# Altium schematic sheet Main.SchDoc
size B portrait; SheetNumber: 1; SheetTotal: 3
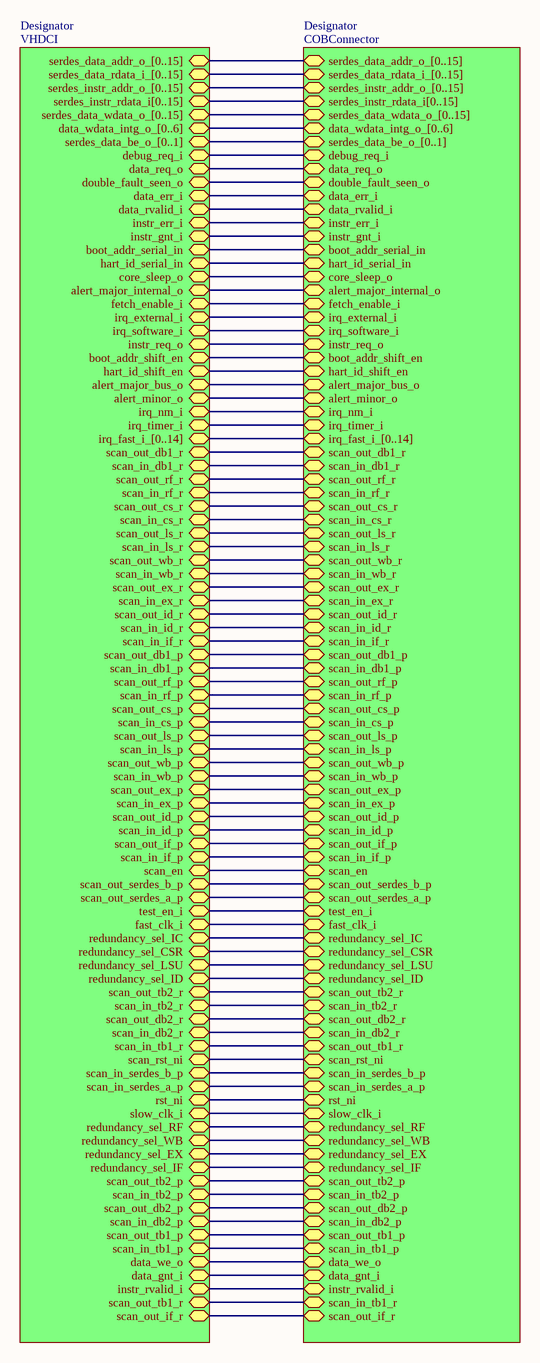
[diagram p0: Main.SchDoc]

## Sub-sheets
Designator = VHDCI: serdes_data_addr_o_[0..15] (bidir), serdes_data_rdata_i_[0..15] (bidir), serdes_instr_addr_o_[0..15] (bidir), serdes_instr_rdata_i[0..15] (bidir), serdes_data_wdata_o_[0..15] (bidir), data_wdata_intg_o_[0..6] (bidir), serdes_data_be_o_[0..1] (bidir), data_req_o (bidir), double_fault_seen_o (bidir), data_err_i (bidir), data_rvalid_i (bidir), instr_err_i (bidir), instr_gnt_i (bidir), boot_addr_serial_in (bidir), hart_id_serial_in (bidir), core_sleep_o (bidir), alert_major_internal_o (bidir), fetch_enable_i (bidir), irq_external_i (bidir), irq_software_i (bidir), instr_req_o (bidir), boot_addr_shift_en (bidir), hart_id_shift_en (bidir), alert_major_bus_o (bidir), alert_minor_o (bidir), irq_nm_i (bidir), irq_timer_i (bidir), irq_fast_i_[0..14] (bidir), scan_out_db1_r (bidir), scan_in_db1_r (bidir), scan_out_rf_r (bidir), scan_in_rf_r (bidir), scan_out_cs_r (bidir), scan_in_cs_r (bidir), scan_out_ls_r (bidir), scan_in_ls_r (bidir), scan_out_wb_r (bidir), scan_in_wb_r (bidir), scan_out_ex_r (bidir), scan_in_ex_r (bidir), scan_out_id_r (bidir), scan_in_id_r (bidir), scan_out_if_r (bidir), scan_in_if_r (bidir), scan_out_db1_p (bidir), scan_in_db1_p (bidir), scan_out_rf_p (bidir), scan_in_rf_p (bidir), scan_out_cs_p (bidir), scan_in_cs_p (bidir), scan_out_ls_p (bidir), scan_in_ls_p (bidir), scan_out_wb_p (bidir), scan_in_wb_p (bidir), scan_out_ex_p (bidir), scan_in_ex_p (bidir), scan_out_id_p (bidir), scan_in_id_p (bidir), scan_out_if_p (bidir), scan_in_if_p (bidir), scan_en (bidir), scan_out_serdes_b_p (bidir), scan_out_serdes_a_p (bidir), test_en_i (bidir), fast_clk_i (bidir), redundancy_sel_IC (bidir), redundancy_sel_CSR (bidir), redundancy_sel_LSU (bidir), redundancy_sel_ID (bidir), scan_out_tb2_r (bidir), scan_in_tb2_r (bidir), scan_out_db2_r (bidir), scan_in_db2_r (bidir), scan_in_tb1_r (bidir), scan_rst_ni (bidir), scan_in_serdes_b_p (bidir), scan_in_serdes_a_p (bidir), rst_ni (bidir), slow_clk_i (bidir), redundancy_sel_RF (bidir), redundancy_sel_WB (bidir), redundancy_sel_EX (bidir), redundancy_sel_IF (bidir), scan_out_tb2_p (bidir), scan_in_tb2_p (bidir), scan_out_db2_p (bidir), scan_in_db2_p (bidir), scan_out_tb1_p (bidir), scan_in_tb1_p (bidir), debug_req_i (bidir), data_we_o (bidir), data_gnt_i (bidir), instr_rvalid_i (bidir), scan_out_tb1_r (bidir)
Designator = COBConnector: serdes_data_addr_o_[0..15] (bidir), serdes_data_rdata_i_[0..15] (bidir), serdes_instr_addr_o_[0..15] (bidir), serdes_data_wdata_o_[0..15] (bidir), data_wdata_intg_o_[0..6] (bidir), serdes_data_be_o_[0..1] (bidir), debug_req_i (bidir), data_req_o (bidir), double_fault_seen_o (bidir), data_err_i (bidir), data_rvalid_i (bidir), data_we_o (bidir), data_gnt_i (bidir), instr_err_i (bidir), instr_gnt_i (bidir), boot_addr_serial_in (bidir), hart_id_serial_in (bidir), core_sleep_o (bidir), alert_major_internal_o (bidir), fetch_enable_i (bidir), irq_external_i (bidir), irq_software_i (bidir), instr_req_o (bidir), boot_addr_shift_en (bidir), hart_id_shift_en (bidir), alert_major_bus_o (bidir), alert_minor_o (bidir), irq_nm_i (bidir), irq_timer_i (bidir), irq_fast_i_[0..14] (bidir), scan_out_db1_r (bidir), scan_in_db1_r (bidir), scan_out_rf_r (bidir), scan_in_rf_r (bidir), scan_out_cs_r (bidir), scan_in_cs_r (bidir), scan_out_ls_r (bidir), scan_in_ls_r (bidir), scan_out_wb_r (bidir), scan_in_wb_r (bidir), scan_out_ex_r (bidir), scan_in_ex_r (bidir), scan_out_id_r (bidir), scan_out_if_r (bidir), scan_in_if_r (bidir), scan_out_db1_p (bidir), scan_in_db1_p (bidir), scan_out_rf_p (bidir), scan_in_rf_p (bidir), scan_out_cs_p (bidir), scan_in_cs_p (bidir), scan_out_ls_p (bidir), scan_in_ls_p (bidir), scan_out_wb_p (bidir), scan_in_wb_p (bidir), scan_out_ex_p (bidir), scan_in_ex_p (bidir), scan_out_id_p (bidir), scan_in_id_p (bidir), scan_out_if_p (bidir), scan_in_if_p (bidir), scan_en (bidir), scan_out_serdes_b_p (bidir), scan_out_serdes_a_p (bidir), test_en_i (bidir), fast_clk_i (bidir), redundancy_sel_IC (bidir), redundancy_sel_CSR (bidir), redundancy_sel_LSU (bidir), redundancy_sel_ID (bidir), scan_out_tb2_r (bidir), scan_in_tb2_r (bidir), scan_out_db2_r (bidir), scan_in_db2_r (bidir), scan_out_tb1_r (bidir), scan_rst_ni (bidir), scan_in_serdes_b_p (bidir), scan_in_serdes_a_p (bidir), rst_ni (bidir), slow_clk_i (bidir), redundancy_sel_RF (bidir), redundancy_sel_WB (bidir), redundancy_sel_EX (bidir), redundancy_sel_IF (bidir), scan_out_tb2_p (bidir), scan_in_tb2_p (bidir), scan_out_db2_p (bidir), scan_in_db2_p (bidir), scan_out_tb1_p (bidir), scan_in_tb1_p (bidir), scan_in_id_r (bidir), serdes_instr_rdata_i[0..15] (bidir), instr_rvalid_i (bidir), scan_in_tb1_r (bidir)

## Nets
(unnamed): sheet Designator/data_req_o, sheet Designator/data_req_o
(unnamed): sheet Designator/double_fault_seen_o, sheet Designator/double_fault_seen_o
(unnamed): sheet Designator/data_err_i, sheet Designator/data_err_i
(unnamed): sheet Designator/data_rvalid_i, sheet Designator/data_rvalid_i
(unnamed): sheet Designator/instr_err_i, sheet Designator/instr_err_i
(unnamed): sheet Designator/instr_gnt_i, sheet Designator/instr_gnt_i
(unnamed): sheet Designator/boot_addr_serial_in, sheet Designator/boot_addr_serial_in
(unnamed): sheet Designator/hart_id_serial_in, sheet Designator/hart_id_serial_in
(unnamed): sheet Designator/core_sleep_o, sheet Designator/core_sleep_o
(unnamed): sheet Designator/alert_major_internal_o, sheet Designator/alert_major_internal_o
(unnamed): sheet Designator/fetch_enable_i, sheet Designator/fetch_enable_i
(unnamed): sheet Designator/irq_external_i, sheet Designator/irq_external_i
(unnamed): sheet Designator/irq_software_i, sheet Designator/irq_software_i
(unnamed): sheet Designator/instr_req_o, sheet Designator/instr_req_o
(unnamed): sheet Designator/boot_addr_shift_en, sheet Designator/boot_addr_shift_en
(unnamed): sheet Designator/hart_id_shift_en, sheet Designator/hart_id_shift_en
(unnamed): sheet Designator/alert_major_bus_o, sheet Designator/alert_major_bus_o
(unnamed): sheet Designator/alert_minor_o, sheet Designator/alert_minor_o
(unnamed): sheet Designator/irq_nm_i, sheet Designator/irq_nm_i
(unnamed): sheet Designator/irq_timer_i, sheet Designator/irq_timer_i
(unnamed): sheet Designator/irq_fast_i_[0..14], sheet Designator/irq_fast_i_[0..14]
(unnamed): sheet Designator/scan_out_db1_r, sheet Designator/scan_out_db1_r
(unnamed): sheet Designator/scan_in_db1_r, sheet Designator/scan_in_db1_r
(unnamed): sheet Designator/scan_out_rf_r, sheet Designator/scan_out_rf_r
(unnamed): sheet Designator/scan_in_rf_r, sheet Designator/scan_in_rf_r
(unnamed): sheet Designator/scan_out_cs_r, sheet Designator/scan_out_cs_r
(unnamed): sheet Designator/scan_in_cs_r, sheet Designator/scan_in_cs_r
(unnamed): sheet Designator/scan_out_ls_r, sheet Designator/scan_out_ls_r
(unnamed): sheet Designator/scan_in_ls_r, sheet Designator/scan_in_ls_r
(unnamed): sheet Designator/scan_out_wb_r, sheet Designator/scan_out_wb_r
(unnamed): sheet Designator/scan_in_wb_r, sheet Designator/scan_in_wb_r
(unnamed): sheet Designator/scan_out_ex_r, sheet Designator/scan_out_ex_r
(unnamed): sheet Designator/scan_in_ex_r, sheet Designator/scan_in_ex_r
(unnamed): sheet Designator/scan_out_id_r, sheet Designator/scan_out_id_r
(unnamed): sheet Designator/scan_in_id_r, sheet Designator/scan_in_id_r
(unnamed): sheet Designator/scan_out_if_r, sheet Designator/scan_out_if_r
(unnamed): sheet Designator/scan_in_if_r, sheet Designator/scan_in_if_r
(unnamed): sheet Designator/scan_out_db1_p, sheet Designator/scan_out_db1_p
(unnamed): sheet Designator/scan_in_db1_p, sheet Designator/scan_in_db1_p
(unnamed): sheet Designator/scan_out_rf_p, sheet Designator/scan_out_rf_p
(unnamed): sheet Designator/scan_in_rf_p, sheet Designator/scan_in_rf_p
(unnamed): sheet Designator/scan_out_cs_p, sheet Designator/scan_out_cs_p
(unnamed): sheet Designator/scan_in_cs_p, sheet Designator/scan_in_cs_p
(unnamed): sheet Designator/scan_out_ls_p, sheet Designator/scan_out_ls_p
(unnamed): sheet Designator/scan_in_ls_p, sheet Designator/scan_in_ls_p
(unnamed): sheet Designator/scan_out_wb_p, sheet Designator/scan_out_wb_p
(unnamed): sheet Designator/scan_in_wb_p, sheet Designator/scan_in_wb_p
(unnamed): sheet Designator/scan_out_ex_p, sheet Designator/scan_out_ex_p
(unnamed): sheet Designator/scan_in_ex_p, sheet Designator/scan_in_ex_p
(unnamed): sheet Designator/scan_out_id_p, sheet Designator/scan_out_id_p
(unnamed): sheet Designator/scan_in_id_p, sheet Designator/scan_in_id_p
(unnamed): sheet Designator/scan_out_if_p, sheet Designator/scan_out_if_p
(unnamed): sheet Designator/scan_in_if_p, sheet Designator/scan_in_if_p
(unnamed): sheet Designator/scan_en, sheet Designator/scan_en
(unnamed): sheet Designator/scan_out_serdes_b_p, sheet Designator/scan_out_serdes_b_p
(unnamed): sheet Designator/scan_out_serdes_a_p, sheet Designator/scan_out_serdes_a_p
(unnamed): sheet Designator/test_en_i, sheet Designator/test_en_i
(unnamed): sheet Designator/fast_clk_i, sheet Designator/fast_clk_i
(unnamed): sheet Designator/redundancy_sel_IC, sheet Designator/redundancy_sel_IC
(unnamed): sheet Designator/redundancy_sel_CSR, sheet Designator/redundancy_sel_CSR
(unnamed): sheet Designator/redundancy_sel_LSU, sheet Designator/redundancy_sel_LSU
(unnamed): sheet Designator/redundancy_sel_ID, sheet Designator/redundancy_sel_ID
(unnamed): sheet Designator/scan_out_tb2_r, sheet Designator/scan_out_tb2_r
(unnamed): sheet Designator/scan_in_tb2_r, sheet Designator/scan_in_tb2_r
(unnamed): sheet Designator/scan_out_db2_r, sheet Designator/scan_out_db2_r
(unnamed): sheet Designator/scan_in_db2_r, sheet Designator/scan_in_db2_r
(unnamed): sheet Designator/scan_in_tb1_r, sheet Designator/scan_out_tb1_r
(unnamed): sheet Designator/scan_rst_ni, sheet Designator/scan_rst_ni
(unnamed): sheet Designator/scan_in_serdes_b_p, sheet Designator/scan_in_serdes_b_p
(unnamed): sheet Designator/scan_in_serdes_a_p, sheet Designator/scan_in_serdes_a_p
(unnamed): sheet Designator/rst_ni, sheet Designator/rst_ni
(unnamed): sheet Designator/slow_clk_i, sheet Designator/slow_clk_i
(unnamed): sheet Designator/redundancy_sel_RF, sheet Designator/redundancy_sel_RF
(unnamed): sheet Designator/redundancy_sel_WB, sheet Designator/redundancy_sel_WB
(unnamed): sheet Designator/redundancy_sel_EX, sheet Designator/redundancy_sel_EX
(unnamed): sheet Designator/redundancy_sel_IF, sheet Designator/redundancy_sel_IF
(unnamed): sheet Designator/scan_out_tb2_p, sheet Designator/scan_out_tb2_p
(unnamed): sheet Designator/scan_in_tb2_p, sheet Designator/scan_in_tb2_p
(unnamed): sheet Designator/scan_out_db2_p, sheet Designator/scan_out_db2_p
(unnamed): sheet Designator/scan_in_db2_p, sheet Designator/scan_in_db2_p
(unnamed): sheet Designator/scan_out_tb1_p, sheet Designator/scan_out_tb1_p
(unnamed): sheet Designator/scan_in_tb1_p, sheet Designator/scan_in_tb1_p
(unnamed): sheet Designator/debug_req_i, sheet Designator/debug_req_i
(unnamed): sheet Designator/data_we_o, sheet Designator/data_we_o
(unnamed): sheet Designator/data_gnt_i, sheet Designator/data_gnt_i
(unnamed): sheet Designator/instr_rvalid_i, sheet Designator/instr_rvalid_i
(unnamed): sheet Designator/scan_out_tb1_r, sheet Designator/scan_in_tb1_r